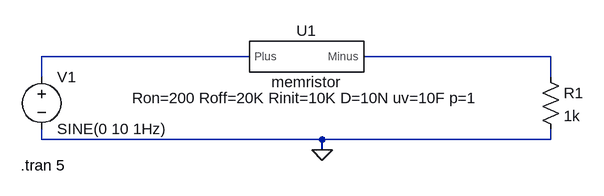
[diagram p0: schematic memristorcharac.asc]
memristorcharac.asc, the LTspice schematic file:
Version 4.1
SHEET 1 880 680
WIRE 288 192 -32 192
WIRE 752 192 464 192
WIRE -32 224 -32 192
WIRE 752 224 752 192
WIRE -32 320 -32 304
WIRE 400 320 -32 320
WIRE 752 320 752 304
WIRE 752 320 400 320
WIRE 400 336 400 320
FLAG 400 336 0
SYMBOL memristor 368 192 R0
SYMATTR InstName U1
SYMATTR SpiceLine Ron=200 Roff=20K Rinit=10K D=10N uv=10F p=1
SYMBOL voltage -32 208 R0
WINDOW 123 0 0 Left 0
WINDOW 39 0 0 Left 0
SYMATTR InstName V1
SYMATTR Value SINE(0 10 1Hz)
SYMBOL res 736 208 R0
SYMATTR InstName R1
SYMATTR Value 1k
TEXT -64 360 Left 2 !.tran 5

The netlist it stands for:
* memristorcharac.asc
X§U1 N001 N002 memristor Ron=200 Roff=20K Rinit=10K D=10N uv=10F p=1  ; pins Plus Minus
V1 N001 0 SINE(0 10 1Hz)
R1 N002 0 1k
.tran 5
.lib C:\Users\daris\Documents\LTspice\memristor.sub
.backanno
.end